# EAGLE design myDRAMTester (EAGLE 9.6.0)
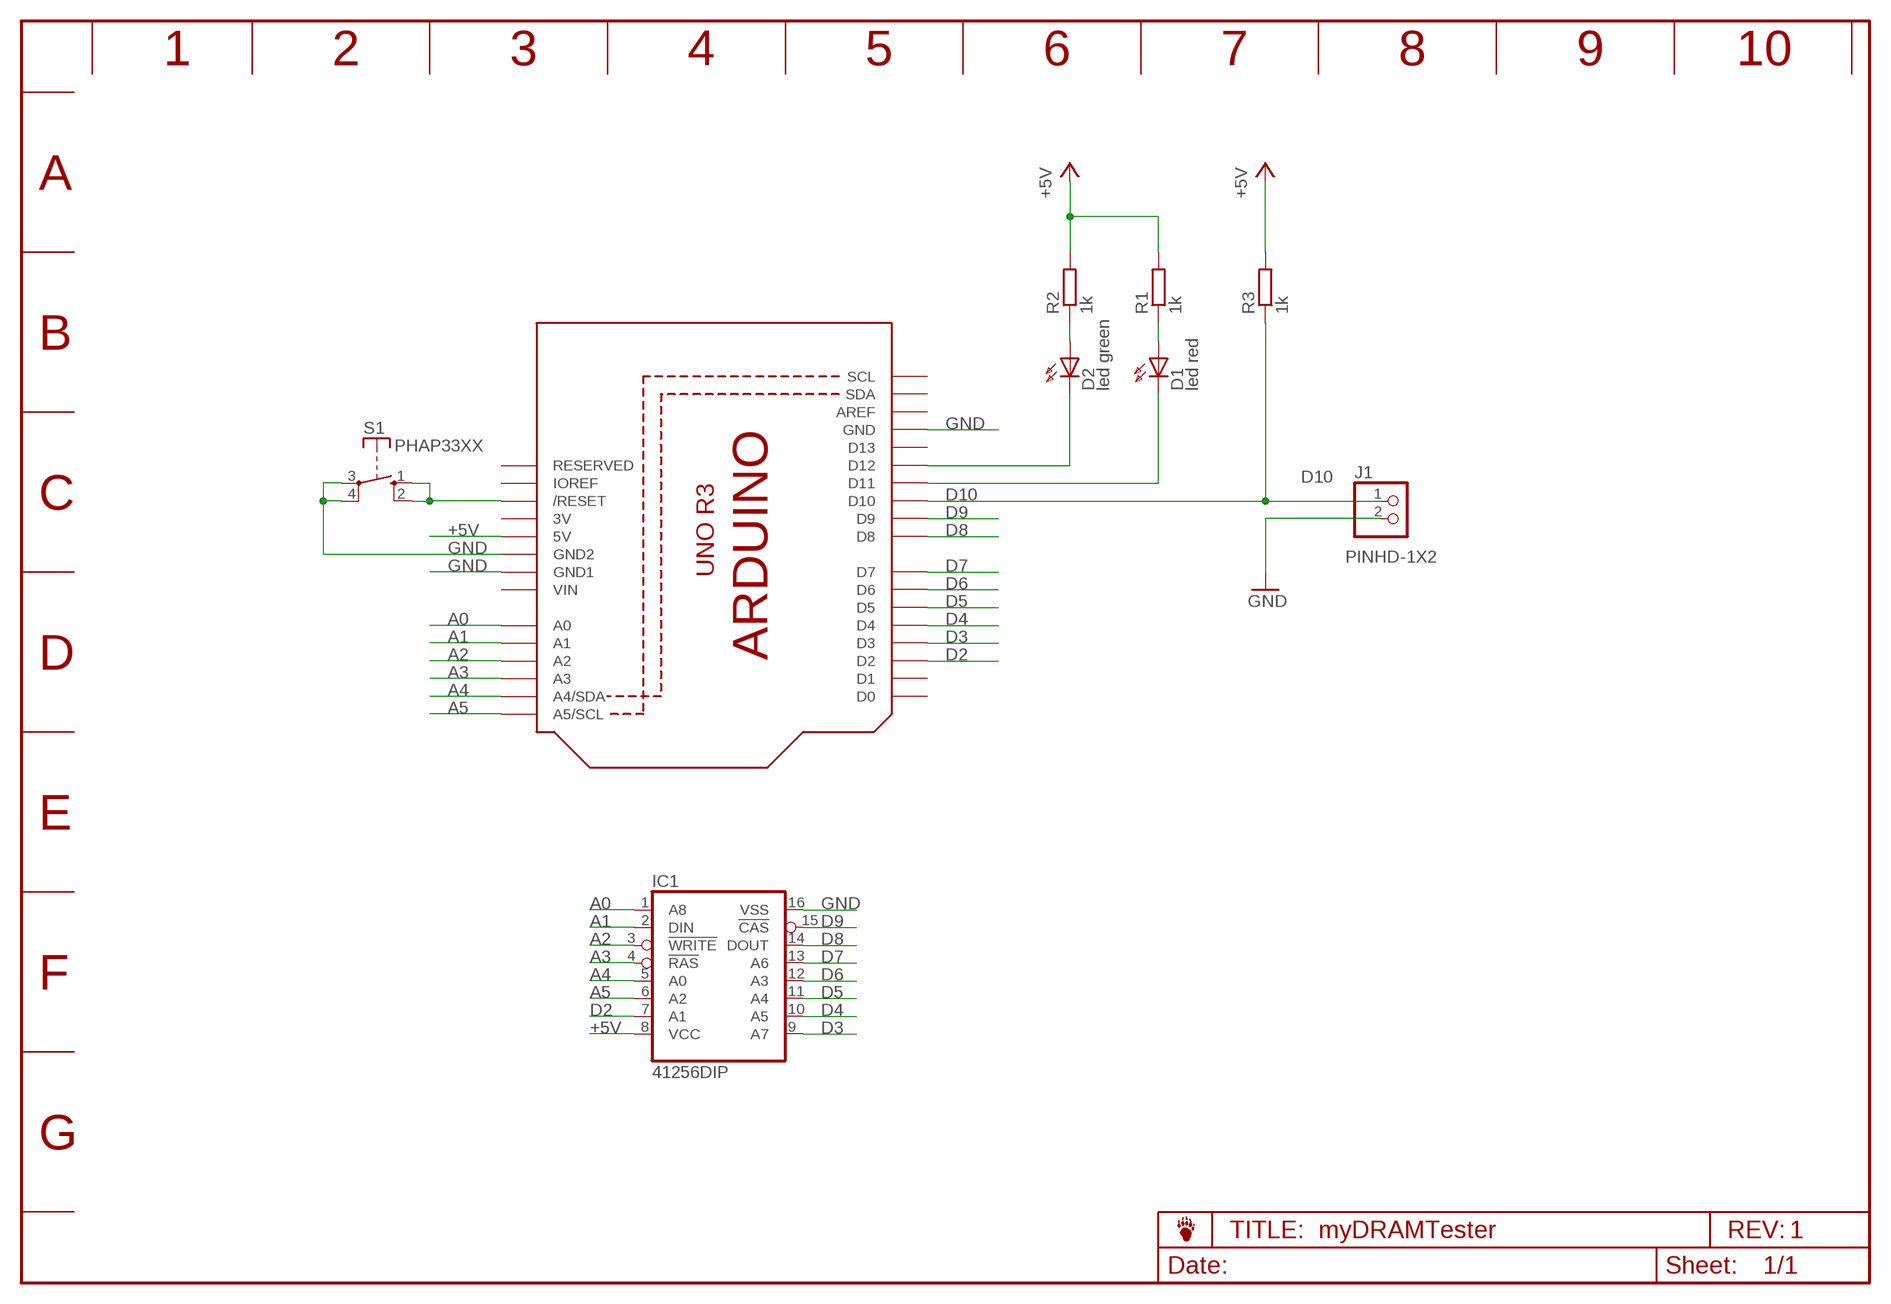
[diagram p0: schematic, sheet 1]

## Parts
D1  led red  LED3MMS  [LED3MM]
D2  led green  LED3MMS  [LED3MM]
IC1  41256DIP  [DIL16]
J1  PINHD-1X2  [1X02]
R1  1k  R-EU_0207/10  [0207/10]
R2  1k  R-EU_0207/10  [0207/10]
R3  1k  R-EU_0207/10  [0207/10]
S1  PHAP33XX  [PHAP33XX]
U2  ARDUINOR3_BBSMALL  [ARDUINOR3S]

## Nets
+5V: IC1.8(VCC) R1.2 R2.2 R3.2 U2.5V
A0: IC1.1(A8) U2.A0
A1: IC1.2(DIN) U2.A1
A2: IC1.3(!WRITE) U2.A2
A3: IC1.4(!RAS) U2.A3
A4: IC1.5(A0) U2.A4(A4/SDA)
A5: IC1.6(A2) U2.A5(A5/SCL)
D2: IC1.7(A1) U2.D2
D3: IC1.9(A7) U2.D3
D4: IC1.10(A5) U2.D4
D5: IC1.11(A4) U2.D5
D6: IC1.12(A3) U2.D6
D7: IC1.13(A6) U2.D7
D8: IC1.14(DOUT) U2.D8
D9: IC1.15(!CAS) U2.D9
D10: J1.1 R3.1 U2.D10
GND: IC1.16(VSS) J1.2 S1.3(P) S1.4(P) U2.GND U2.GND1 U2.GND2
N$1: D2.K(C) U2.D12
N$2: D1.K(C) U2.D11
N$3: D2.A R2.1
N$4: D1.A R1.1
N$5: S1.1(S) S1.2(S) U2.RESET(/RESET)
Unconnected: U2.AREF U2.D0 U2.D1 U2.D13 U2.IOREF U2.RESERVED U2.SCL U2.SDA

## Notes on the sheet
- 1

## Power pins joined to a net without a drawn wire
3V: U2.3V
VIN: U2.VIN

## Library data of the parts
D1 D2 = Led_bb:LED3MM: LED 3 mm, round
IC1 = socket_bb:41256
J1 = pinhead2_bb:PINHD-1X2
R1-R3 = rcl_bb:R-EU_: RESISTOR, European symbol
S1 = switch_bb:PHAP33XX
U2 = adafruit_bb:ARDUINOR3_BB: This is a new object for the new Arduino R3 - with extra pins that you may want to use (such as IOref, and duplicated A4/A5

## Board
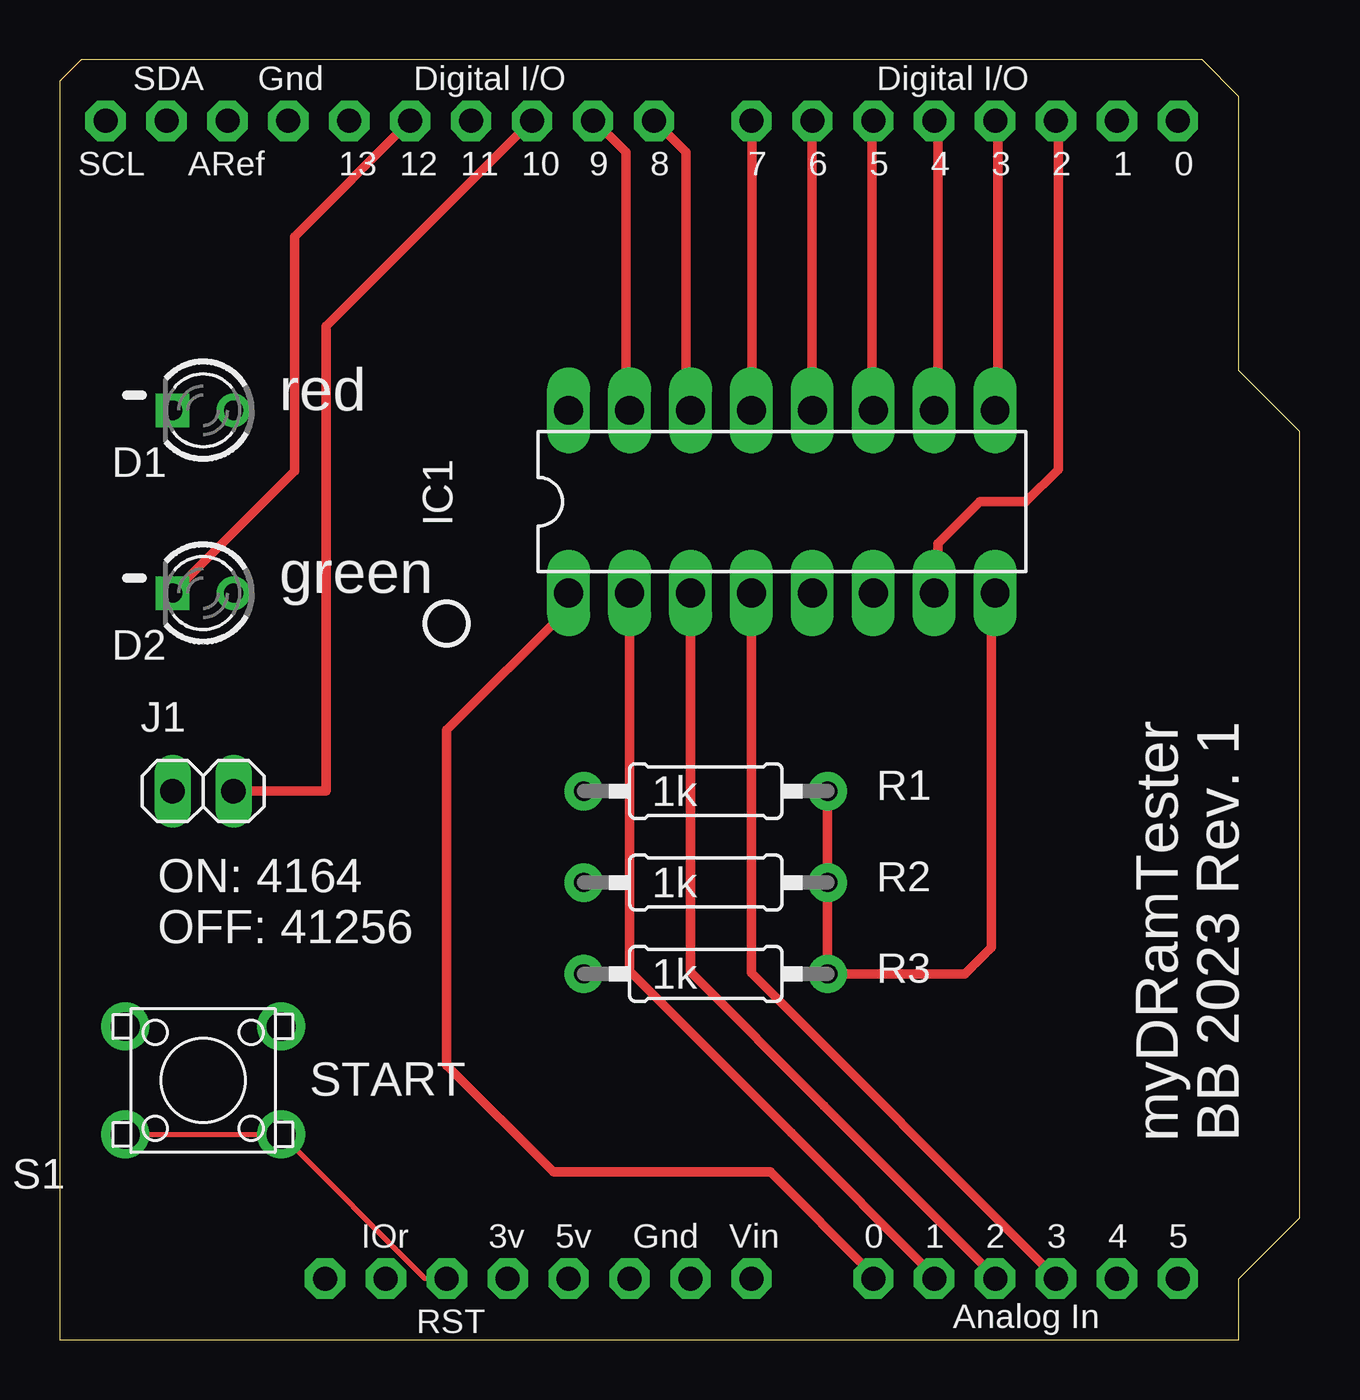
[diagram p1: board, top side]
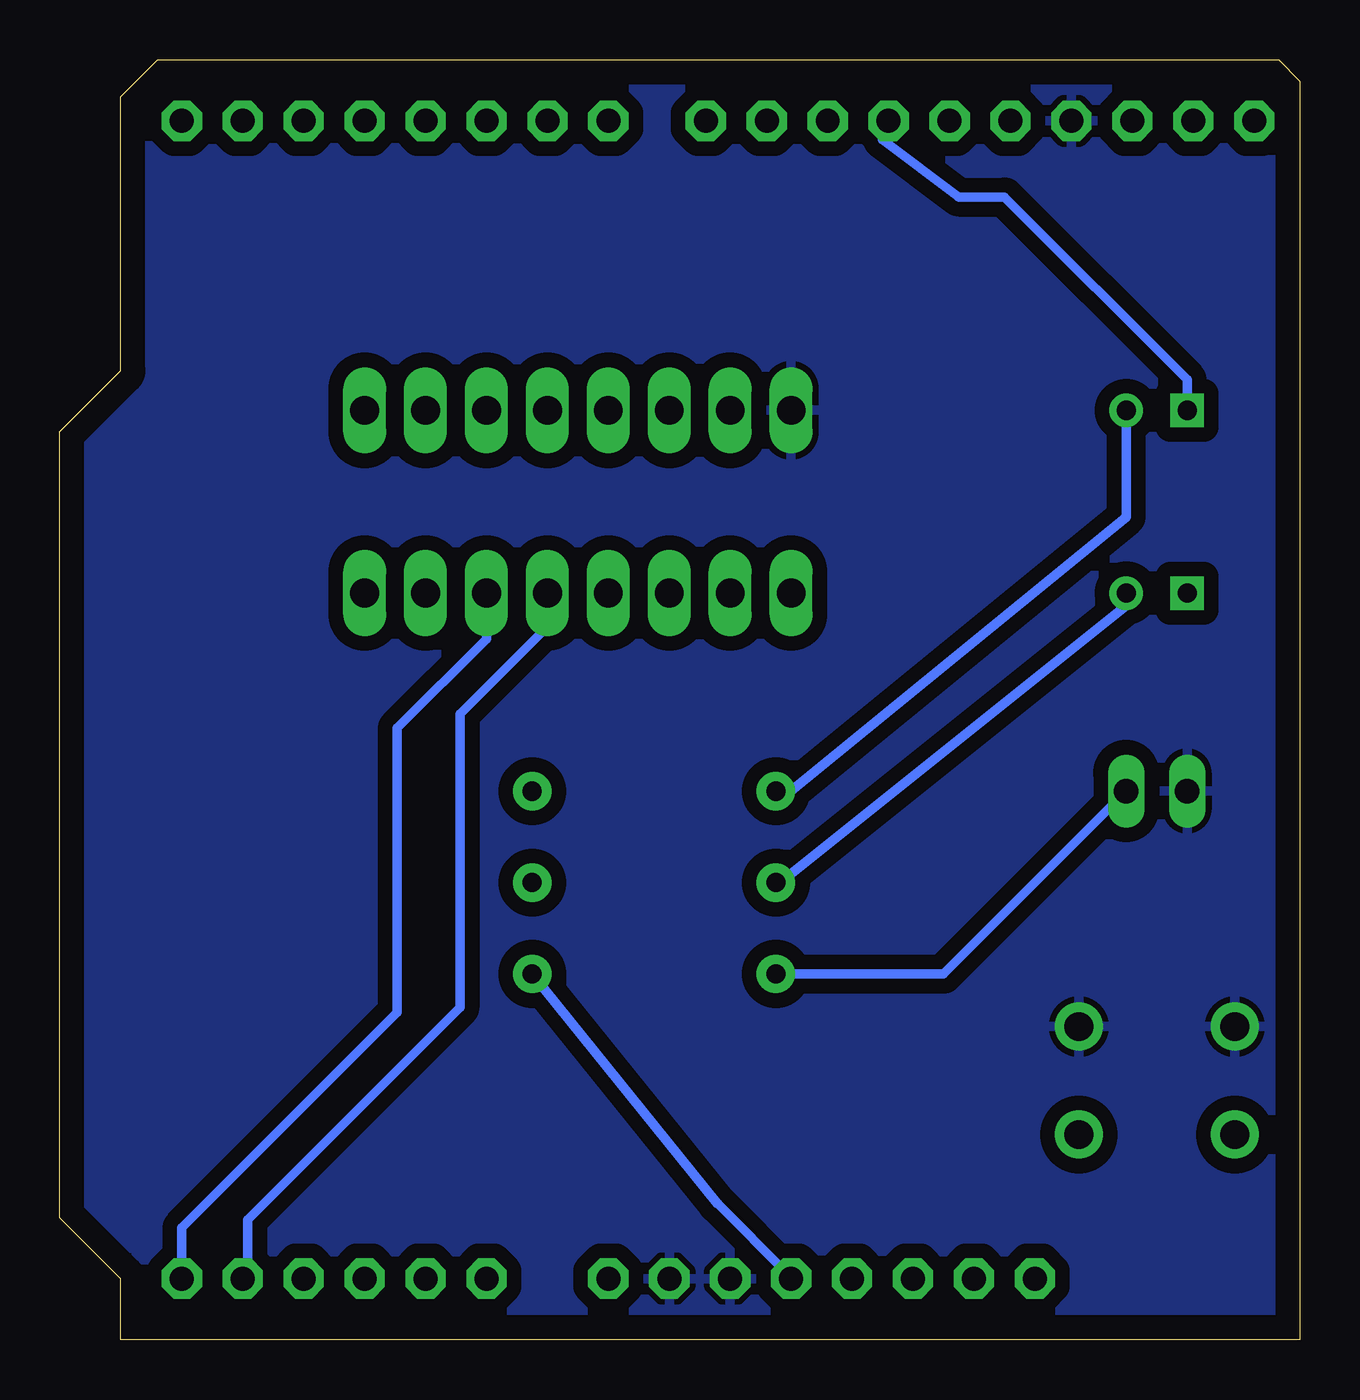
[diagram p2: board, bottom side, seen from below]

Size 51.69 x 53.34 mm. Coordinates in mm from the lower left corner, seen from the top.
Copper layers (1*16): Top 0.035mm / dielectric 1.5mm / Bottom 0.035mm
Design rules "default": minimum track width 6mil, minimum drill 0.35mm, track to track 6mil, track to pad 6mil, pad to pad 6mil, via to via 6mil, smd to smd 6mil, copper to edge 40mil, drill to drill 6mil, minimum pad ring 10mil, minimum via ring 8mil, stop-mask expansion 4mil, vias tented up to drill 0mil, thermal gap 10mil

### Footprints (pad centres in the part's own frame; a part is rotated, then mirrored left to right if it is on the bottom)
LED3MM = drill 0.8 pad 1.4: A -1.27,0 | drill 0.8 pad 1.4 square: K 1.27,0
DIL16 = drill 1.2 long: 1 -8.89,-3.81; 2 -6.35,-3.81; 3 -3.81,-3.81; 4 -1.27,-3.81; 5 1.27,-3.81; 6 3.81,-3.81; 7 6.35,-3.81; 8 8.89,-3.81; 9 8.89,3.81; 10 6.35,3.81; 11 3.81,3.81; 12 1.27,3.81; 13 -1.27,3.81; 14 -3.81,3.81; 15 -6.35,3.81; 16 -8.89,3.81
1X02 = drill 1.016 long: 1 -1.27,0; 2 1.27,0
0207/10 = drill 0.8 pad 1.6: 1 -5.08,0; 2 5.08,0
PHAP33XX = drill 1.2 pad 2: 1 -2.25,-3.25; 2 -2.25,3.25; 3 2.25,-3.25; 4 2.25,3.25
ARDUINOR3S = drill 1 pad 1.676 octagon: 3V 35.56,2.54; 5V 38.1,2.54; A0 50.8,2.54; A1 53.34,2.54; A2 55.88,2.54; A3 58.42,2.54; A4 60.96,2.54; A5 63.5,2.54; AREF 23.876,50.8; D0 63.5,50.8; D1 60.96,50.8; D2 58.42,50.8; D3 55.88,50.8; D4 53.34,50.8; D5 50.8,50.8; D6 48.26,50.8; D7 45.72,50.8; D8 41.656,50.8; D9 39.116,50.8; D10 36.576,50.8; D11 34.036,50.8; D12 31.496,50.8; D13 28.956,50.8; GND 26.416,50.8; GND1 43.18,2.54; GND2 40.64,2.54; IOREF 30.48,2.54; RESERVED 27.94,2.54; RESET 33.02,2.54; SCL 18.796,50.8; SDA 21.336,50.8; VIN 45.72,2.54

### Placement (x,y rotation side)
D1  5.96,38.73 180 top
D2  5.96,31.11 180 top
IC1  30.1,34.92 0 top
J1  5.96,22.86 180 top
R1  26.92,22.86 0 top
R2  26.92,19.05 0 top
R3  26.92,15.24 0 top
S1  5.96,10.79 90 top
U2  -16.89,0 0 top

### Tracks (layer width: path | path; a pad name or v marks a point on that pad's centre or on a via)
+5V
  Top 0.152: 38.82,30.96 38.86,31 IC1.8
  Top 0.4: 38.82,30.96 38.82,16.34 37.72,15.24 R3.2 R2.2 R1.2
  Bottom 0.152: 24.26,5.66 24.28,5.66 | 21.36,2.75 U2.5V
  Bottom 0.4: 21.36,2.75 24.26,5.66 | 24.28,5.66 R3.2
A0
  Top 0.152: 33.86,2.75 U2.A0
  Top 0.2: IC1.1 21.21,30.48
  Top 0.4: 33.86,2.75 29.62,6.99 20.57,6.99 16.13,11.43 16.13,25.4 21.21,30.48
A1
  Top 0.152: 36.36,2.75 U2.A1
  Top 0.4: 36.36,2.75 30.49,8.62 23.75,15.36 IC1.2
A2
  Top 0.152: 38.86,2.75 U2.A2
  Top 0.4: 38.86,2.75 31.86,9.75 26.29,15.32 IC1.3
A3
  Top 0.152: 41.36,2.75 U2.A3
  Top 0.4: IC1.4 28.82,15.28 41.36,2.75
A4
  Bottom 0.152: 43.86,2.75 U2.A4
  Bottom 0.4: 43.86,2.75 43.86,5 35.01,13.85 35.01,26.07 31.25,29.83 IC1.5
A5
  Bottom 0.4: U2.A5 46.61,4.66 37.62,13.64 37.62,25.49 33.91,29.21 IC1.6
D2
  Top 0.152: U2.D2 41.62,50.7 | 36.61,31.25 IC1.7
  Top 0.4: 41.62,50.7 41.62,36.27 40.25,34.92 38.35,34.92 36.61,33.18 36.61,31.25
D3
  Top 0.152: 39.11,50.75 U2.D3 | 39.11,38.75 IC1.9
  Top 0.4: 39.11,38.75 39.11,50.75
D4
  Top 0.152: 36.61,50.75 U2.D4 | 36.61,38.75 IC1.10
  Top 0.4: 36.61,38.75 36.61,50.75
D5
  Top 0.152: 33.86,50.75 U2.D5 | 33.86,38.75 IC1.11
  Top 0.4: 33.86,38.75 33.86,50.75
D6
  Top 0.152: 31.36,50.75 U2.D6 | 31.36,38.75 IC1.12
  Top 0.4: 31.36,38.75 31.36,50.75
D7
  Top 0.152: 28.86,50.75 U2.D7 | 28.86,38.75 IC1.13
  Top 0.4: 28.86,38.75 28.86,50.75
D8
  Top 0.152: 24.86,50.75 U2.D8 | 26.11,38.75 IC1.14
  Top 0.4: 24.86,50.75 26.11,49.5 26.11,38.75
D9
  Top 0.152: 22.36,50.75 U2.D9 | 23.61,38.75 IC1.15
  Top 0.4: 22.36,50.75 23.61,49.5 23.61,38.75
D10
  Top 0.152: 19.61,50.75 U2.D10
  Top 0.4: 19.61,50.75 11.11,42.25 11.11,22.86 J1.1
  Bottom 0.4: R3.1 14.86,15.24 J1.1
GND
  pour Bottom (isolate 0.61): 0.25,52.7 0.25,0.64 48.51,0.64 48.51,3.81 49.15,3.81 51.05,5.71 51.05,37.47 48.51,40.01 48.51,51.44 47.24,52.7
N$1
  Top 0.4: D2.K 9.78,36.2 9.78,45.97 U2.D12
N$2
  Bottom 0.4: U2.D11 17.39,50.55 17.39,50.01 14.22,47.62 12.32,47.62 4.7,40.01 D1.K
N$3
  Bottom 0.152: 21.61,19.25 R2.1
  Bottom 0.4: 21.61,19.25 21.43,19.25 7.23,30.6 D2.A
N$4
  Bottom 0.4: R1.1 21.21,22.86 7.23,34.29 D1.A
N$5
  Top 0.2: S1.2 S1.1 15.22,2.54 U2.RESET

### Text on the board
tNames: red | green | ON: 4164 / OFF: 41256 | START | myDRamTester | BB 2023 Rev. 1